# Altium schematic sheet Top_Design.SchDoc
size A4; SheetNumber: 1; SheetTotal: 3
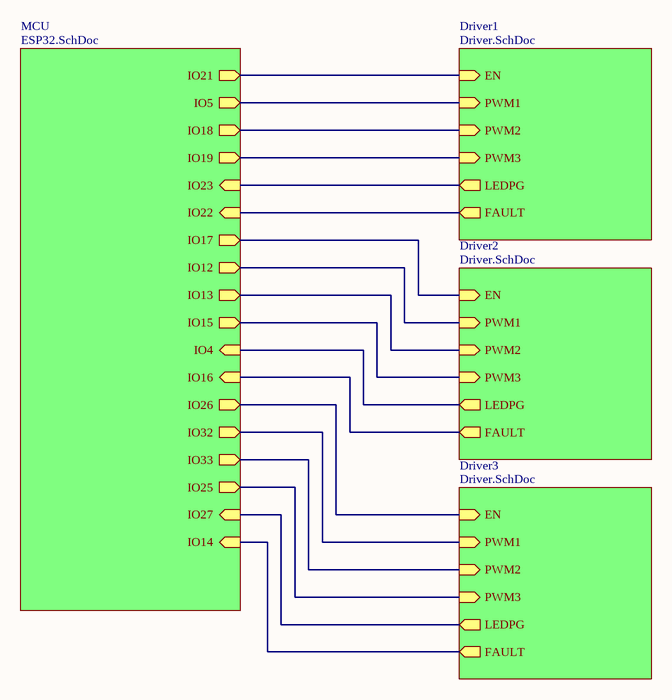
[diagram p0: Top_Design.SchDoc]

## Sub-sheets
Driver1 = Driver.SchDoc: EN (in), PWM1 (in), PWM2 (in), PWM3 (in), LEDPG (out), FAULT (out)
Driver2 = Driver.SchDoc: EN (in), PWM1 (in), PWM2 (in), PWM3 (in), LEDPG (out), FAULT (out)
Driver3 = Driver.SchDoc: EN (in), PWM1 (in), PWM2 (in), PWM3 (in), LEDPG (out), FAULT (out)
MCU = ESP32.SchDoc: IO21 (out), IO5 (out), IO18 (out), IO19 (out), IO23 (in), IO22 (in), IO17 (out), IO12 (out), IO13 (out), IO15 (out), IO4 (in), IO16 (in), IO26 (out), IO32 (out), IO33 (out), IO25 (out), IO27 (in), IO14 (in)

## Nets
(unnamed): sheet Driver1/EN, sheet MCU/IO21
(unnamed): sheet Driver1/PWM1, sheet MCU/IO5
(unnamed): sheet Driver1/PWM2, sheet MCU/IO18
(unnamed): sheet Driver1/PWM3, sheet MCU/IO19
(unnamed): sheet Driver1/LEDPG, sheet MCU/IO23
(unnamed): sheet Driver1/FAULT, sheet MCU/IO22
(unnamed): sheet MCU/IO17, sheet Driver2/EN
(unnamed): sheet MCU/IO12, sheet Driver2/PWM1
(unnamed): sheet MCU/IO13, sheet Driver2/PWM2
(unnamed): sheet MCU/IO15, sheet Driver2/PWM3
(unnamed): sheet MCU/IO4, sheet Driver2/LEDPG
(unnamed): sheet MCU/IO16, sheet Driver2/FAULT
(unnamed): sheet MCU/IO26, sheet Driver3/EN
(unnamed): sheet MCU/IO32, sheet Driver3/PWM1
(unnamed): sheet MCU/IO33, sheet Driver3/PWM2
(unnamed): sheet MCU/IO25, sheet Driver3/PWM3
(unnamed): sheet MCU/IO27, sheet Driver3/LEDPG
(unnamed): sheet MCU/IO14, sheet Driver3/FAULT